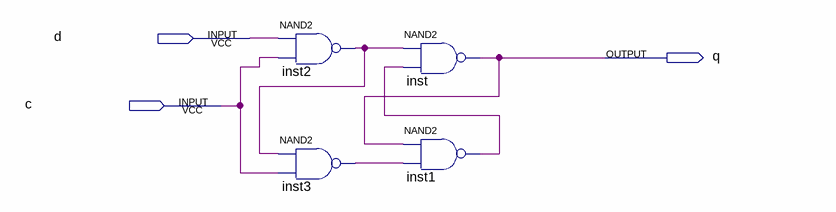
[diagram p0: schematic sheet]
// Quartus schematic d.bdf as structural Verilog: 4 symbols, 3 pins
module d (
  input  d,
  input  c,
  output q
);

  wire inst1_out, inst2_out, inst3_out;

  nand inst2 (inst2_out, d, c);
  nand inst3 (inst3_out, inst2_out, c);
  nand inst (q, inst2_out, inst1_out);
  nand inst1 (inst1_out, q, inst3_out);
endmodule
